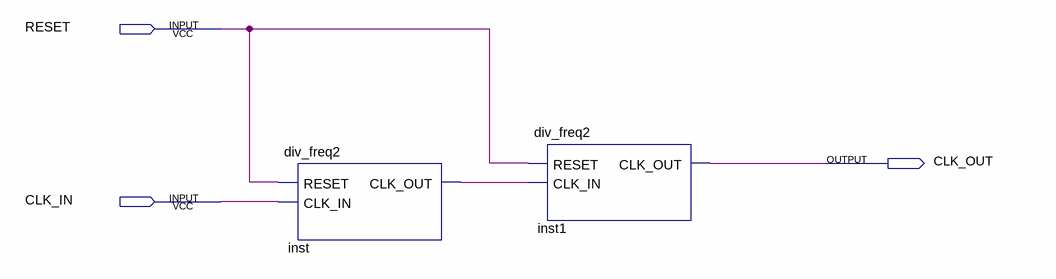
[diagram p0: schematic sheet]
// Quartus schematic div_freq4.bdf as structural Verilog: 2 symbols, 3 pins
module div_freq4 (
  input  RESET,
  input  CLK_IN,
  output CLK_OUT
);

  wire inst_clk_out;

  div_freq2 inst (.RESET(RESET), .CLK_IN(CLK_IN), .CLK_OUT(inst_clk_out));
  div_freq2 inst1 (.RESET(RESET), .CLK_IN(inst_clk_out), .CLK_OUT(CLK_OUT));
endmodule
